# EAGLE design ECG (EAGLE 7.2.0)
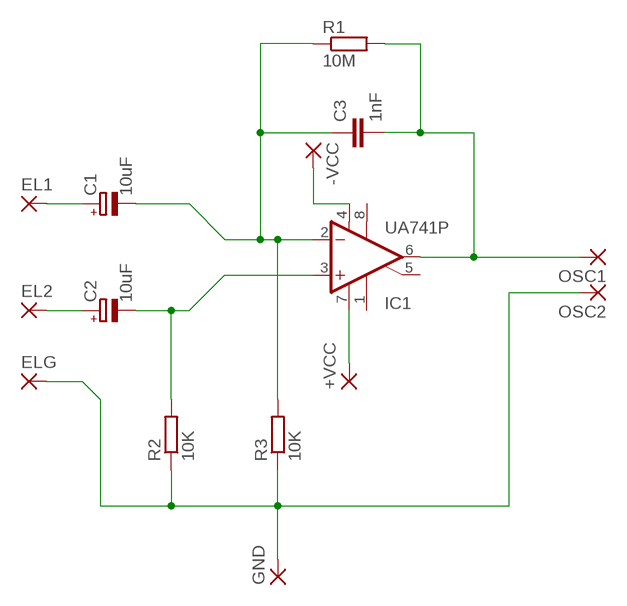
[diagram p0: schematic, sheet 1]

## Parts
+VCC  1,6/0,8  [1,6/0,8]
-VCC  1,6/0,8  [1,6/0,8]
C1  10uF  CPOL-EUE1.8-4  [E1,8-4]
C2  10uF  CPOL-EUE1.8-4  [E1,8-4]
C3  1nF  C-EU025-024X044  [C025-024X044]
EL1  1,6/0,8  [1,6/0,8]
EL2  1,6/0,8  [1,6/0,8]
ELG  1,6/0,8  [1,6/0,8]
GND  1,6/0,8  [1,6/0,8]
IC1  UA741P  [DIL08]
OSC1  1,6/0,8  [1,6/0,8]
OSC2  1,6/0,8  [1,6/0,8]
R1  10M  R-EU_0207/7  [0207/7]
R2  10K  R-EU_0207/7  [0207/7]
R3  10K  R-EU_0207/7  [0207/7]

## Nets
N$1: C1.+ EL1.1(P)
N$2: C2.- IC1.3(+IN) R2.2
N$3: C1.- C3.1 IC1.2(-IN) R1.1 R3.2
N$4: C3.2 IC1.6(OUT) OSC1.1(P) R1.2
N$5: ELG.1(P) GND.1(P) OSC2.1(P) R2.1 R3.1
N$6: -VCC.1(P) IC1.4(V-)
N$7: +VCC.1(P) IC1.7(V+)
N$8: C2.+ EL2.1(P)
Unconnected: IC1.1(ON1) IC1.5(ON2) IC1.8(OPT)

## Library data of the parts
+VCC -VCC EL1 EL2 ELG GND OSC1 OSC2 = wirepad:1,6/0,8: THROUGH-HOLE PAD
C1 C2 = rcl:CPOL-EU: POLARIZED CAPACITOR, European symbol
C3 = rcl:C-EU: CAPACITOR, European symbol
IC1 = linear:*741: OP AMP
R1-R3 = rcl:R-EU_: RESISTOR, European symbol

## Board
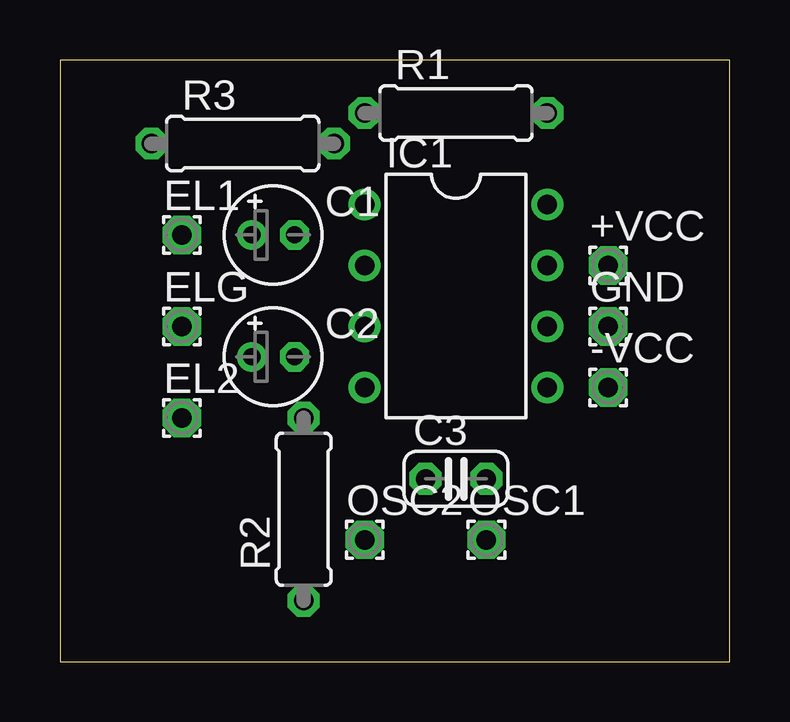
[diagram p1: board, top side]
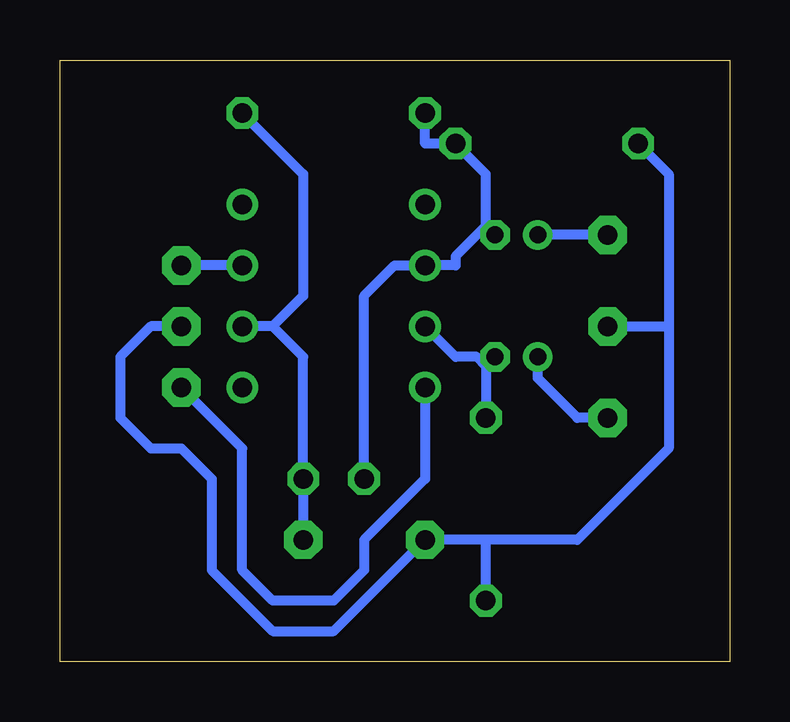
[diagram p2: board, bottom side, seen from below]

Size 27.92 x 25.07 mm. Coordinates in mm from the lower left corner, seen from the top.
Outline: 0,0 27.92,0 27.92,25.07 0,25.07 0,0
Copper layers (1*16): Top 0.035mm / dielectric 1.5mm / Bottom 0.035mm
Design rules "default": minimum track width 10mil, minimum drill 24mil, track to track 8mil, track to pad 8mil, pad to pad 8mil, via to via 8mil, smd to smd 8mil, copper to edge 40mil, drill to drill 8mil, minimum pad ring 10mil, minimum via ring 8mil, stop-mask expansion 4mil, vias tented up to drill 0mil, thermal gap 10mil

### Footprints (pad centres in the part's own frame; a part is rotated, then mirrored left to right if it is on the bottom)
1,6/0,8 = drill 0.813 pad 1.6 octagon: 1 0,0
E1,8-4 = drill 0.711 pad 1.168: + -0.889,0 | drill 0.711 pad 1.168 octagon: - 0.889,0
C025-024X044 = drill 0.813 octagon: 1 -1.27,0; 2 1.27,0
DIL08 = drill 0.813 pad 1.27: 1 -3.81,-3.81; 2 -1.27,-3.81; 3 1.27,-3.81; 4 3.81,-3.81; 5 3.81,3.81; 6 1.27,3.81; 7 -1.27,3.81; 8 -3.81,3.81
0207/7 = drill 0.813 octagon: 1 -3.81,0; 2 3.81,0

### Placement (x,y rotation side)
+VCC  22.86,16.51 0 top
-VCC  22.86,11.43 0 top
C1  8.89,17.78 0 top
C2  8.89,12.7 0 top
C3  16.51,7.62 0 top
EL1  5.08,17.78 0 top
EL2  5.08,10.16 0 top
ELG  5.08,13.97 0 top
GND  22.86,13.97 0 top
IC1  16.51,15.24 270 top
OSC1  17.78,5.08 0 top
OSC2  12.7,5.08 0 top
R1  16.51,22.86 0 top
R2  10.16,6.35 90 top
R3  7.62,21.59 0 top

### Tracks (layer width: path | path; a pad name or v marks a point on that pad's centre or on a via)
N$1
  Bottom 0.406: EL1.1 C1.+
N$2
  Bottom 0.406: C2.- 10.16,12.32 | 10.16,12.32 R2.2 | 10.16,12.32 10.54,12.7 11.43,12.7 IC1.3
N$3
  Bottom 0.406: C1.- 10.16,18.16 | 10.16,18.16 10.16,20.32 R3.2 12.7,21.59 R1.1 | 10.16,18.16 11.43,16.89 11.43,16.51 IC1.2 13.97,16.51 15.24,15.24 C3.1
N$4
  Bottom 0.406: 19.05,13.97 17.78,12.7 C3.2 OSC1.1 | 19.05,13.97 IC1.6 | R1.2 17.78,20.32 17.78,15.24 19.05,13.97
N$5
  Bottom 0.406: R3.1 2.54,20.32 2.54,13.97 | R2.1 10.16,5.08 | 10.16,5.08 OSC2.1 16.51,1.27 19.05,1.27 21.59,3.81 21.59,7.62 22.86,8.89 24.13,8.89 25.4,10.16 25.4,12.7 24.13,13.97 GND.1 | ELG.1 2.54,13.97 | 2.54,13.97 2.54,8.89 6.35,5.08 10.16,5.08
N$6
  Bottom 0.406: IC1.4 12.7,7.62 15.24,5.08 15.24,3.81 16.51,2.54 19.05,2.54 20.32,3.81 20.32,8.89 -VCC.1
N$7
  Bottom 0.406: IC1.7 +VCC.1
N$8
  Bottom 0.406: EL2.1 6.35,10.16 8,11.81 C2.+